# EAGLE design Bias_Lighting_Controller_Schematic (EAGLE 9.2.2)
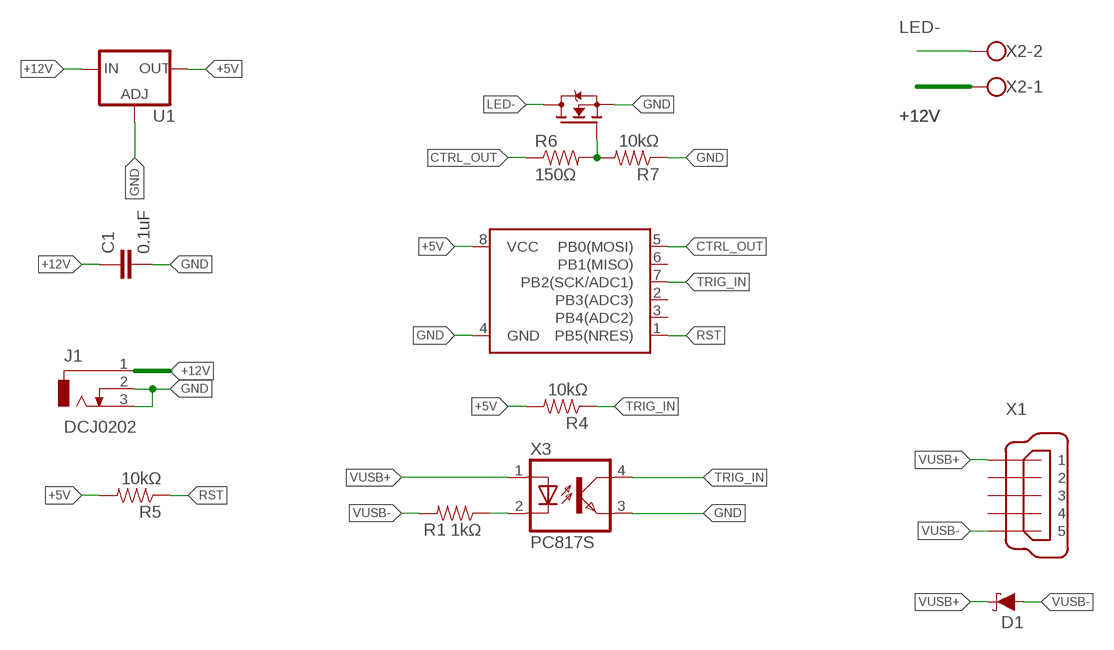
[diagram p0: schematic, sheet 1]

## Parts
ATTINY85  ATTINY45  [SO08-EIAJ]
C1  0.1uF  C-EUC1206K  [C1206K]
D1  DIODE-SCHOTTKY-SS14  [SMA-DIODE]
IRF740_MOSFET1  MOSFET-N-SOT23  [SOT23]
J1  DCJ0202  [DCJ0202]
R1  1kΩ  RESISTOR1206  [1206]
R4  10kΩ  RESISTOR1206  [1206]
R5  10kΩ  RESISTOR1206  [1206]
R6  150Ω  RESISTOR1206  [1206]
R7  10kΩ  RESISTOR1206  [1206]
U1  V_REG_317SMD  [SOT223]
X1  MINI-USB-UX60-MB-5ST  [UX60-MB-5ST]
X2  W237-102  [W237-102]
X3  PC817S  [PC817SMT]

## Nets
+5V: ATTINY85.8(VCC) R4.2 R5.2 U1.2(OUT)
+12V: C1.1 J1.1 U1.3(IN) X2.1
CTRL_OUT: ATTINY85.5(PB0(MOSI)) R6.1
GND: ATTINY85.4(GND) C1.2 IRF740_MOSFET1.2(S) J1.2 J1.3 R7.1 U1.1(ADJ) X3.3(EMIT)
LED-: IRF740_MOSFET1.3(D) X2.2
N$6: IRF740_MOSFET1.1(G) R6.2 R7.2
RST: ATTINY85.1(PB5(NRES)) R5.1
TRIG-: R1.1 X3.2(C)
TRIG_IN: ATTINY85.7(PB2(SCK/ADC1)) R4.1 X3.4(COL)
VUSB+: D1.C X1.1 X3.1(A)
VUSB-: D1.A R1.2 X1.5
Unconnected: ATTINY85.2(PB3(ADC3)) ATTINY85.3(PB4(ADC2)) ATTINY85.6(PB1(MISO)) X1.2 X1.3 X1.4

## Library data of the parts
ATTINY85 = SparkFun-DigitalIC:ATTINY45: Atmel 8-pin 2/4/8kB flash uC
C1 = GDOv5 Board:C-EU: CAPACITOR, European symbol
D1 = SparkFun-DiscreteSemi:DIODE-SCHOTTKY: Schottky diode A Schottky diode is a semiconductor diode which has a low forward voltage drop and a very fast switching action.; PROD_ID: DIO-08053; VALUE: 1A/40V/500mV
IRF740_MOSFET1 = we-transistor:MOSFET-N: N-Channel MOSFET (e.g. IRLML2502, BSS138)
J1 = con-jack:DCJ0202: DC POWER JACK Source: DCJ0202.pdf; OC_FARNELL: unknown; OC_NEWARK: unknown
R1 R4-R7 = SparkFun-Resistors:RESISTOR: Resistor Basic schematic elements and footprints for 0603, 1206, and PTH resistors.
U1 = SparkFun-IC-Power:V_REG_317: Voltage Regulator Standard LM317 adjustable voltage regulator. AOI (Adjust Output Input). Google 'LM317 Calculator' for easy to use app to get the two resistor values needed. 240/720 for 5V output. 240/390 for 3.3V output. Spark Fun Electronics SKU : COM-00527
X1 = con-hirose:MINI-USB-: MINI USB Connector Source: http://www.hirose.co.jp/cataloge_hp/e24000019.pdf; OC_FARNELL: unknown; OC_NEWARK: unknown
X2 = con-wago-500:W237-102: WAGO SCREW CLAMP; MPN: 237-102; OC_FARNELL: unknown; OC_NEWARK: 70K9898
X3 = GadgetFactory_v1:PC817

## Board
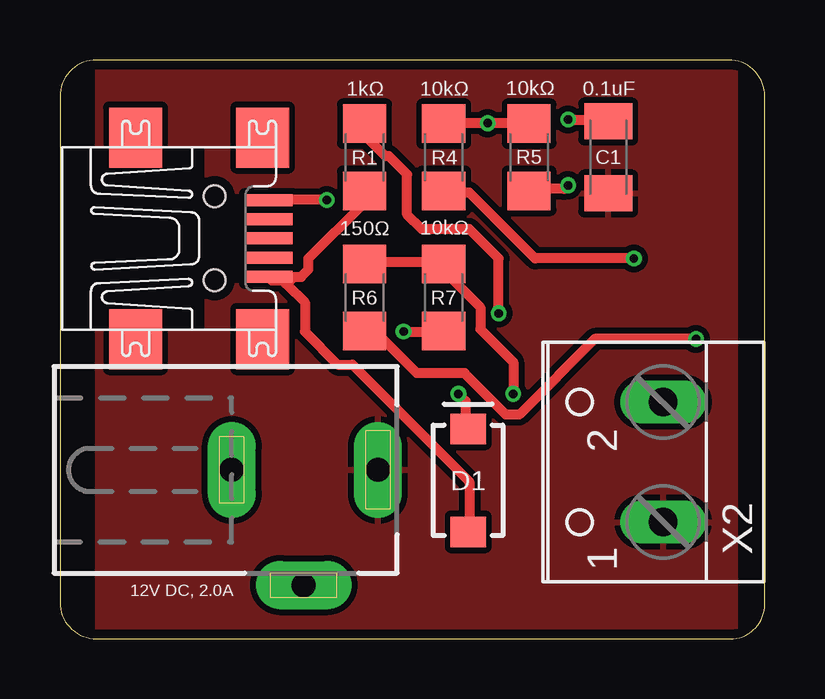
[diagram p1: board, top side]
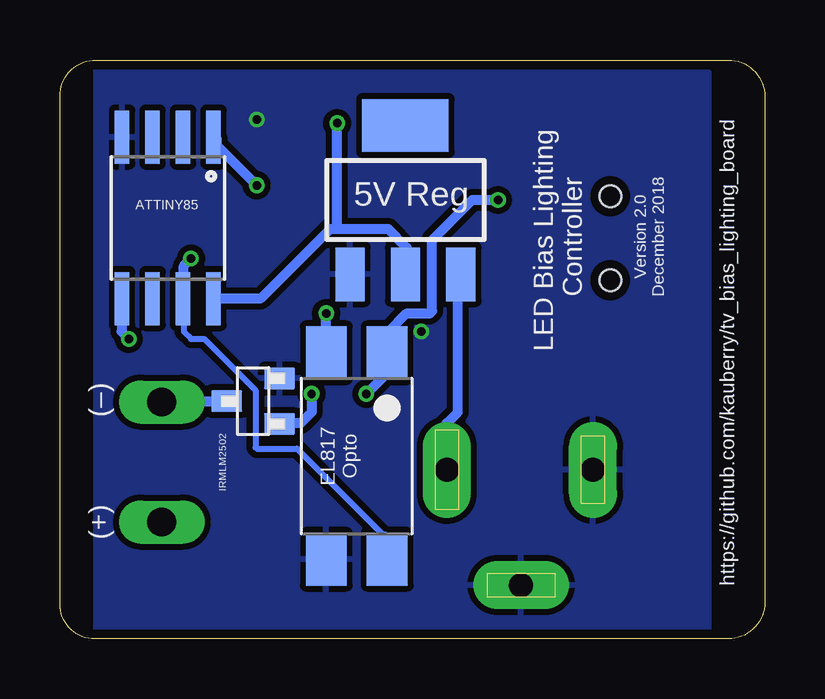
[diagram p2: board, bottom side, seen from below]

Size 29.39 x 24.12 mm. Coordinates in mm from the lower left corner, seen from the top.
Outline: 1.52,0 27.94,0 arc90 29.39,1.45 29.39,22.61 arc90 27.87,24.12 1.52,24.12 arc90 0,22.6 0,1.52 arc90 1.52,0
Copper layers (1*16): Top 0.035559375mm / dielectric 1.6mm / Bottom 0.035559375mm
Design rules "oshpark-2layer-auto-routing": minimum track width 10mil, minimum drill 10mil, track to track 10mil, track to pad 8mil, pad to pad 8mil, via to via 8mil, smd to smd 6mil, copper to edge 15mil, drill to drill 6mil, minimum pad ring 6mil, minimum via ring 6mil, stop-mask expansion 2.5mil, vias tented up to drill 0mil, thermal gap 10mil

### Footprints (pad centres in the part's own frame; a part is rotated, then mirrored left to right if it is on the bottom)
SO08-EIAJ = smd 0.61 x 2.21: 1 -1.905,-3.378; 2 -0.635,-3.378; 3 0.635,-3.378; 4 1.905,-3.378; 5 1.905,3.353; 6 0.635,3.353; 7 -0.635,3.353; 8 -1.905,3.353
C1206K = smd 1.5 x 2: 1 -1.5,0; 2 1.5,0
SMA-DIODE = smd 1.27 x 1.47: A -2.15,0; C 2.15,0
SOT23 = smd 1.3 x 0.9: 1 -1.1,0.95; 2 -1.1,-0.95; 3 1.1,0
DCJ0202 = drill 1 pad 2 long: 1 0,3.1; 2 4.8,0; 3 0,-3
1206 = smd 1.6 x 1.8: 1 -1.4,0; 2 1.4,0
SOT223 = smd 1.219 x 2.235: 1 -2.311,-3.099; 2 0,-3.099; 3 2.311,-3.099 | smd 3.6 x 2.2: 4 0,3.099
UX60-MB-5ST = smd 2 x 0.5: 1 2.25,1.6; 2 2.25,0.8; 3 2.25,0; 4 2.25,-0.8; 5 2.25,-1.6 | smd 2.2 x 2.5: M1 -3.3,-4.2; M2 -3.3,4.2; M3 2,4.2; M4 2,-4.2 | hole 0.9: 0,-1.75; 0,1.75
W237-102 = drill 1.194 long: 1 -2.5,-1.27; 2 2.5,-1.27
PC817SMT = smd 1.7 x 2.2: 1 -1.27,-4.3; 2 1.27,-4.3; 3 1.27,4.3; 4 -1.27,4.3

### Placement (x,y rotation side)
ATTINY85  24.89,17.53 180 bottom
C1  22.86,20.07 90 top
D1  17.02,6.6 90 top
IRF740_MOSFET1  21.34,9.91 180 bottom
J1  10.16,7.04 270 top
R1  12.7,20.07 270 top
R4  16,20.07 90 top
R5  19.56,20.07 90 top
R6  12.7,14.22 90 top
R7  16,14.22 90 top
U1  14.99,18.29 0 bottom
X1  6.45,16.69 0 top
X2  23.88,7.37 90 top
X3  17.02,7.62 180 bottom

### Tracks (layer width: path | path; a pad name or v marks a point on that pad's centre or on a via)
+5V  (via drill 0.35)
  Top 0.406: R4.2 16,21.49 v17.83,21.49 19.51,21.49 R5.2
  Bottom 0.406: ATTINY85.8 21.03,14.17 18.14,17.07 17.83,17.07 | 17.83,17.07 15.7,17.07 14.94,16.31 14.94,15.24 U1.2 | 17.83,17.07 v17.83,21.49
+12V
  Bottom 0.406: U1.3 12.8,15.09 12.8,9.45 13.26,8.99 13.26,7.16 J1.1
  pour Top: 1.52,23.88 1.52,0.25 28.19,0.25 28.19,23.88
CTRL_OUT  (via drill 0.35)
  Top 0.406: v26.52,12.5 22.3,12.5 19.15,9.35 18.59,9.35 16.87,11.07 14.88,11.07 13.16,12.8 12.8,12.8 R6.1
  Bottom 0.406: v26.52,12.5 26.82,12.8 26.82,14.17 ATTINY85.5
GND  (via drill 0.35)
  Top 0.406: v14.33,12.8 16,12.8 R7.1 | v21.18,21.64 22.86,21.64 C1.2
  pour Bottom: 2.29,23.62 2.29,0.25 27.94,0.25 27.94,24.13 2.79,24.13
LED-
  Bottom 0.406: IRF740_MOSFET1.3 25.15,9.91 X2.2
N$6  (via drill 0.35)
  Top 0.406: v18.9,10.21 18.9,11.53 17.53,12.9 17.53,13.82 16,15.34 R7.2 16,15.7 12.8,15.7 R6.2
  Bottom 0.406: v18.9,10.21 18.9,9.45 19.36,8.99 20.12,8.99 IRF740_MOSFET1.1
RST  (via drill 0.35)
  Top 0.406: v21.18,18.9 21.03,18.75 19.66,18.75 R5.1
  Bottom 0.406: v21.18,18.9 22.86,20.57 22.86,20.88 ATTINY85.1
TRIG-  (via drill 0.35)
  Top 0.406: v18.29,13.56 18.29,15.85 17.07,17.07 15.09,17.07 14.48,17.68 14.48,19.36 13.72,20.12 13.56,20.12 12.8,20.88 12.8,21.34 R1.1
  Bottom 0.406: X3.2 v18.29,13.56
TRIG_IN  (via drill 0.35)
  Top 0.406: v23.93,15.85 19.81,15.85 17.07,18.59 16,18.59 R4.1
  Bottom 0.254: 15.85,4.27 19.51,7.92 21.18,7.92 21.23,7.98 21.23,10.36 23.37,12.5 23.93,12.5 24.23,12.8 24.23,14.17
  Bottom 0.406: v23.93,15.85 24.23,15.54 24.23,14.17 ATTINY85.7 | 15.85,4.27 15.85,3.35 X3.4
VUSB+  (via drill 0.35)
  Top 0.406: v16.61,10.21 16.92,9.91 16.92,8.84 D1.C | v11.12,18.29 8.84,18.29 X1.1
  Bottom 0.406: v16.61,10.21 15.85,10.97 15.85,11.89 X3.1 15.7,12.04 15.7,12.8 14.94,13.56 13.97,13.56 13.87,13.66 13.87,16.61 12.19,18.29 v11.12,18.29
VUSB-
  Top 0.406: 9.45,14.78 9.3,14.94 8.84,14.94 X1.5 | 9.45,14.78 10.21,14.02 10.21,12.8 11.58,11.43 12.19,11.43 17.07,6.55 17.07,4.57 D1.A | 9.45,14.78 9.75,15.09 10.06,15.09 10.36,15.39 10.36,15.85 12.65,18.14 12.65,18.59 R1.2

### Text on the board
tNames: 12V DC, 2.0A
bNames: 5V Reg | Version 2.0 / December 2018 | LED Bias Lighting / Controller | https://github.com/kauberry/tv_bias_lighting_board | (–) | EL817 / Opto | IRMLM2502 | (+)